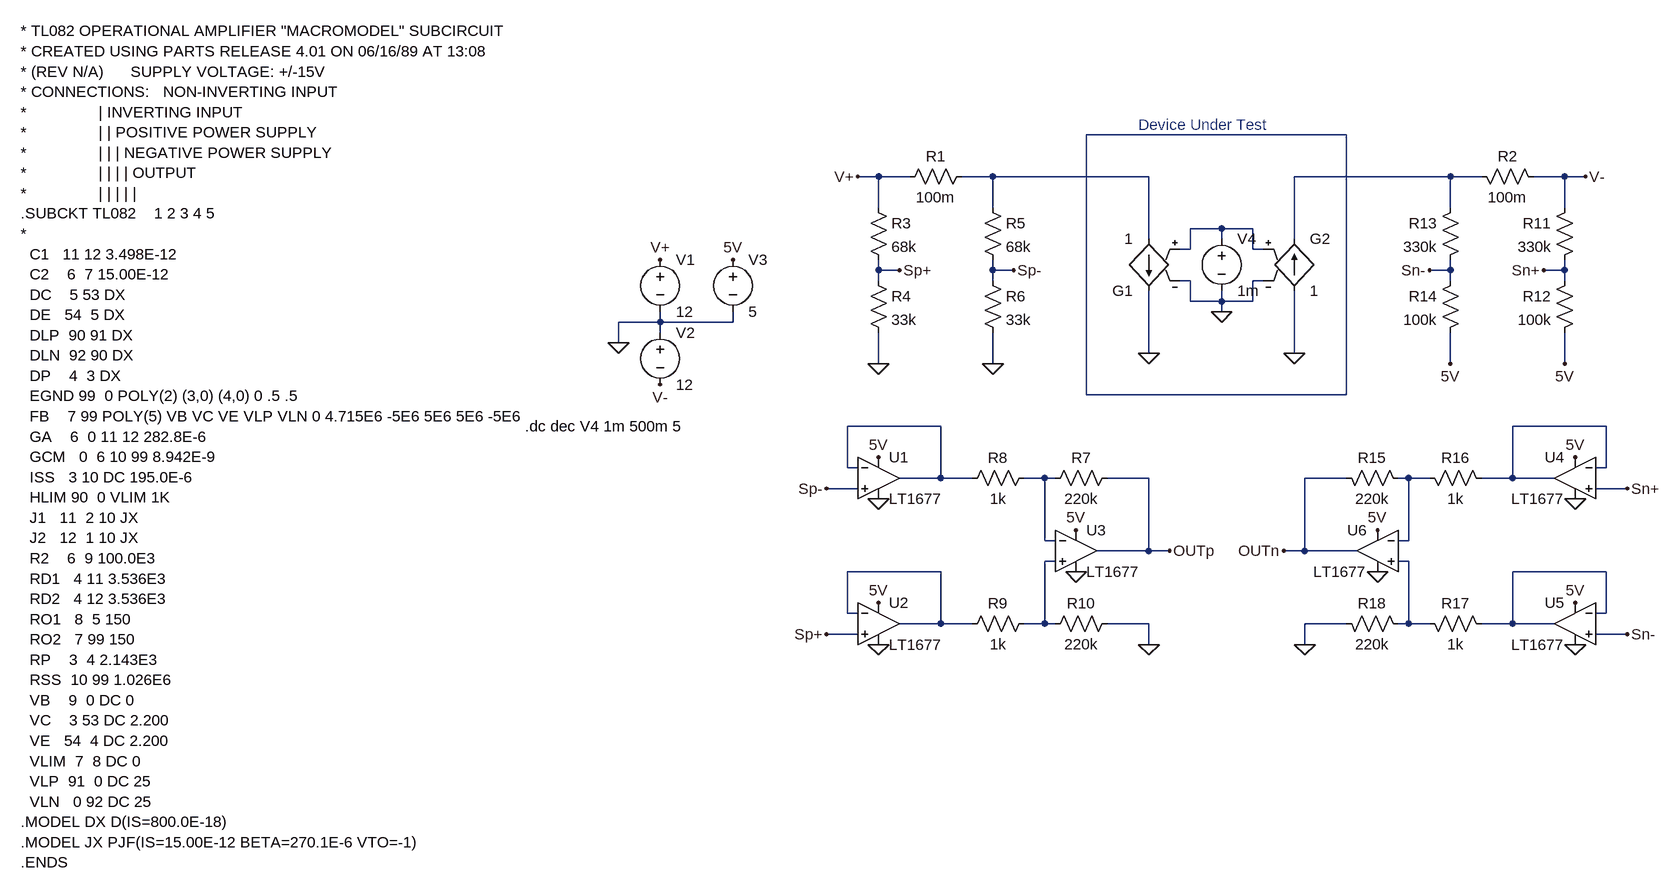
[diagram p0: schematic ModuleTester.asc]
ModuleTester.asc, the LTspice schematic file:
Version 4
SHEET 1 2688 2848
WIRE 368 -96 -32 -96
WIRE -352 -32 -384 -32
WIRE -304 -32 -352 -32
WIRE -176 -32 -224 -32
WIRE 64 -32 -176 -32
WIRE 528 -32 288 -32
WIRE 576 -32 528 -32
WIRE 704 -32 656 -32
WIRE 736 -32 704 -32
WIRE -352 16 -352 -32
WIRE -176 16 -176 -32
WIRE 528 16 528 -32
WIRE 704 16 704 -32
WIRE 176 48 128 48
WIRE 224 48 176 48
WIRE 64 64 64 -32
WIRE 176 64 176 48
WIRE 288 64 288 -32
WIRE 128 80 128 48
WIRE 128 80 112 80
WIRE 224 80 224 48
WIRE 240 80 224 80
WIRE -352 112 -352 96
WIRE -320 112 -352 112
WIRE -176 112 -176 96
WIRE -144 112 -176 112
WIRE 528 112 528 96
WIRE 528 112 496 112
WIRE 704 112 704 96
WIRE 704 112 672 112
WIRE -352 128 -352 112
WIRE -176 128 -176 112
WIRE 128 128 112 128
WIRE 240 128 224 128
WIRE 528 128 528 112
WIRE 704 128 704 112
WIRE 128 160 128 128
WIRE 176 160 176 144
WIRE 176 160 128 160
WIRE 224 160 224 128
WIRE 224 160 176 160
WIRE 176 176 176 160
WIRE -688 192 -688 176
WIRE -688 192 -752 192
WIRE -576 192 -576 176
WIRE -576 192 -688 192
WIRE -688 208 -688 192
WIRE -752 224 -752 192
WIRE 64 240 64 144
WIRE 288 240 288 144
WIRE -352 256 -352 208
WIRE -176 256 -176 208
WIRE 528 256 528 208
WIRE 704 256 704 208
WIRE -32 304 -32 -96
WIRE 368 304 368 -96
WIRE 368 304 -32 304
WIRE -256 352 -400 352
WIRE 768 352 624 352
WIRE -400 416 -400 352
WIRE -384 416 -400 416
WIRE 768 416 768 352
WIRE 768 416 752 416
WIRE -256 432 -256 352
WIRE -256 432 -320 432
WIRE -208 432 -256 432
WIRE -96 432 -128 432
WIRE -80 432 -96 432
WIRE 64 432 0 432
WIRE 368 432 304 432
WIRE 464 432 448 432
WIRE 496 432 464 432
WIRE 624 432 624 352
WIRE 624 432 576 432
WIRE 688 432 624 432
WIRE -384 448 -432 448
WIRE 800 448 752 448
WIRE -96 528 -96 432
WIRE -80 528 -96 528
WIRE 464 528 464 432
WIRE 464 528 448 528
WIRE 64 544 64 432
WIRE 64 544 -16 544
WIRE 96 544 64 544
WIRE 304 544 304 432
WIRE 304 544 272 544
WIRE 384 544 304 544
WIRE -80 560 -96 560
WIRE 464 560 448 560
WIRE -256 576 -400 576
WIRE 768 576 624 576
WIRE -400 640 -400 576
WIRE -384 640 -400 640
WIRE 768 640 768 576
WIRE 768 640 752 640
WIRE -256 656 -256 576
WIRE -256 656 -320 656
WIRE -208 656 -256 656
WIRE -96 656 -96 560
WIRE -96 656 -128 656
WIRE -80 656 -96 656
WIRE 64 656 0 656
WIRE 368 656 304 656
WIRE 464 656 464 560
WIRE 464 656 448 656
WIRE 496 656 464 656
WIRE 624 656 624 576
WIRE 624 656 576 656
WIRE 688 656 624 656
WIRE -384 672 -432 672
WIRE 800 672 752 672
WIRE 64 688 64 656
WIRE 304 688 304 656
FLAG -752 224 0
FLAG -688 288 V-
FLAG -688 96 V+
FLAG -384 -32 V+
FLAG 64 240 0
FLAG -352 256 0
FLAG -320 112 Sp+
FLAG -176 256 0
FLAG -144 112 Sp-
FLAG -576 96 5V
FLAG -432 672 Sp+
FLAG -432 448 Sp-
FLAG 64 688 0
FLAG 96 544 OUTp
FLAG -48 576 0
FLAG -352 688 0
FLAG -352 464 0
FLAG -352 400 5V
FLAG -48 512 5V
FLAG -352 624 5V
FLAG 736 -32 V-
FLAG 288 240 0
FLAG 672 112 Sn+
FLAG 496 112 Sn-
FLAG 176 176 0
FLAG 528 256 5V
FLAG 704 256 5V
FLAG 800 448 Sn+
FLAG 800 672 Sn-
FLAG 304 688 0
FLAG 272 544 OUTn
FLAG 416 576 0
FLAG 720 688 0
FLAG 720 464 0
FLAG 720 400 5V
FLAG 416 512 5V
FLAG 720 624 5V
SYMBOL voltage -688 80 R0
WINDOW 123 0 0 Left 0
WINDOW 39 0 0 Left 0
SYMATTR InstName V1
SYMATTR Value 12
SYMBOL voltage -688 192 R0
WINDOW 123 0 0 Left 0
WINDOW 39 0 0 Left 0
SYMATTR InstName V2
SYMATTR Value 12
SYMBOL res -208 -48 R90
WINDOW 0 0 56 VBottom 2
WINDOW 3 32 56 VTop 2
SYMATTR InstName R1
SYMATTR Value 100m
SYMBOL res -368 0 R0
SYMATTR InstName R3
SYMATTR Value 68k
SYMBOL res -368 112 R0
SYMATTR InstName R4
SYMATTR Value 33k
SYMBOL res -192 0 R0
SYMATTR InstName R5
SYMATTR Value 68k
SYMBOL res -192 112 R0
SYMATTR InstName R6
SYMATTR Value 33k
SYMBOL voltage -576 80 R0
WINDOW 123 0 0 Left 0
WINDOW 39 0 0 Left 0
SYMATTR InstName V3
SYMATTR Value 5
SYMBOL res 16 416 R90
WINDOW 0 0 56 VBottom 2
WINDOW 3 32 56 VTop 2
SYMATTR InstName R7
SYMATTR Value 220k
SYMBOL res -112 416 R90
WINDOW 0 0 56 VBottom 2
WINDOW 3 32 56 VTop 2
SYMATTR InstName R8
SYMATTR Value 1k
SYMBOL res -112 640 R90
WINDOW 0 0 56 VBottom 2
WINDOW 3 32 56 VTop 2
SYMATTR InstName R9
SYMATTR Value 1k
SYMBOL res 16 640 R90
WINDOW 0 0 56 VBottom 2
WINDOW 3 32 56 VTop 2
SYMATTR InstName R10
SYMATTR Value 220k
SYMBOL Opamps\\LT1677 -352 368 R0
SYMATTR InstName U1
SYMBOL Opamps\\LT1677 -352 592 R0
SYMATTR InstName U2
SYMBOL Opamps\\LT1677 -48 480 R0
SYMATTR InstName U3
SYMBOL g2 64 160 R180
SYMATTR InstName G1
SYMATTR Value 1
SYMBOL voltage 176 48 R0
WINDOW 123 0 0 Left 0
WINDOW 39 0 0 Left 0
SYMATTR InstName V4
SYMATTR Value 1m
SYMBOL res 560 -48 M90
WINDOW 0 0 56 VBottom 2
WINDOW 3 32 56 VTop 2
SYMATTR InstName R2
SYMATTR Value 100m
SYMBOL res 720 0 M0
SYMATTR InstName R11
SYMATTR Value 330k
SYMBOL res 720 112 M0
SYMATTR InstName R12
SYMATTR Value 100k
SYMBOL g 288 48 R0
SYMATTR InstName G2
SYMATTR Value 1
SYMBOL res 544 0 M0
SYMATTR InstName R13
SYMATTR Value 330k
SYMBOL res 544 112 M0
SYMATTR InstName R14
SYMATTR Value 100k
SYMBOL res 352 416 M90
WINDOW 0 0 56 VBottom 2
WINDOW 3 32 56 VTop 2
SYMATTR InstName R15
SYMATTR Value 220k
SYMBOL res 480 416 M90
WINDOW 0 0 56 VBottom 2
WINDOW 3 32 56 VTop 2
SYMATTR InstName R16
SYMATTR Value 1k
SYMBOL res 480 640 M90
WINDOW 0 0 56 VBottom 2
WINDOW 3 32 56 VTop 2
SYMATTR InstName R17
SYMATTR Value 1k
SYMBOL res 352 640 M90
WINDOW 0 0 56 VBottom 2
WINDOW 3 32 56 VTop 2
SYMATTR InstName R18
SYMATTR Value 220k
SYMBOL Opamps\\LT1677 720 368 M0
SYMATTR InstName U4
SYMBOL Opamps\\LT1677 720 592 M0
SYMATTR InstName U5
SYMBOL Opamps\\LT1677 416 480 M0
SYMATTR InstName U6
TEXT -1672 -256 Left 2 !* TL082 OPERATIONAL AMPLIFIER "MACROMODEL" SUBCIRCUIT\n* CREATED USING PARTS RELEASE 4.01 ON 06/16/89 AT 13:08\n* (REV N/A)      SUPPLY VOLTAGE: +/-15V\n* CONNECTIONS:   NON-INVERTING INPUT\n*                | INVERTING INPUT\n*                | | POSITIVE POWER SUPPLY\n*                | | | NEGATIVE POWER SUPPLY\n*                | | | | OUTPUT\n*                | | | | |\n.SUBCKT TL082    1 2 3 4 5\n*\n  C1   11 12 3.498E-12\n  C2    6  7 15.00E-12\n  DC    5 53 DX\n  DE   54  5 DX\n  DLP  90 91 DX\n  DLN  92 90 DX\n  DP    4  3 DX\n  EGND 99  0 POLY(2) (3,0) (4,0) 0 .5 .5\n  FB    7 99 POLY(5) VB VC VE VLP VLN 0 4.715E6 -5E6 5E6 5E6 -5E6\n  GA    6  0 11 12 282.8E-6\n  GCM   0  6 10 99 8.942E-9\n  ISS   3 10 DC 195.0E-6\n  HLIM 90  0 VLIM 1K\n  J1   11  2 10 JX\n  J2   12  1 10 JX\n  R2    6  9 100.0E3\n  RD1   4 11 3.536E3\n  RD2   4 12 3.536E3\n  RO1   8  5 150\n  RO2   7 99 150\n  RP    3  4 2.143E3\n  RSS  10 99 1.026E6\n  VB    9  0 DC 0\n  VC    3 53 DC 2.200\n  VE   54  4 DC 2.200\n  VLIM  7  8 DC 0\n  VLP  91  0 DC 25\n  VLN   0 92 DC 25\n.MODEL DX D(IS=800.0E-18)\n.MODEL JX PJF(IS=15.00E-12 BETA=270.1E-6 VTO=-1)\n.ENDS
TEXT -896 352 Left 2 !.dc dec V4 1m 500m 5
TEXT 48 -112 Left 2 ;Device Under Test

The netlist it stands for:
* ModuleTester.asc
V1 V+ 0 12
V2 0 V- 12
R1 N002 V+ 100m
R3 V+ Sp+ 68k
R4 Sp+ 0 33k
R5 N002 Sp- 68k
R6 Sp- 0 33k
V3 5V 0 5
R7 OUTp N007 220k
R8 N007 N005 1k
R9 N009 N011 1k
R10 0 N009 220k
XU1 Sp- N005 5V 0 N005 LT1677  ; pins In+ In- V+ V- OUT
XU2 Sp+ N011 5V 0 N011 LT1677  ; pins In+ In- V+ V- OUT
XU3 N009 N007 5V 0 OUTp LT1677  ; pins In+ In- V+ V- OUT
G1 N002 0 N004 0 1
V4 N004 0 1m
R2 N003 V- 100m
R11 V- Sn+ 330k
R12 Sn+ 5V 100k
G2 0 N003 N004 0 1
R13 N003 Sn- 330k
R14 Sn- 5V 100k
R15 OUTn N008 220k
R16 N008 N006 1k
R17 N010 N012 1k
R18 0 N010 220k
XU4 Sn+ N006 5V 0 N006 LT1677  ; pins In+ In- V+ V- OUT
XU5 Sn- N012 5V 0 N012 LT1677  ; pins In+ In- V+ V- OUT
XU6 N010 N008 5V 0 OUTn LT1677  ; pins In+ In- V+ V- OUT
* TL082 OPERATIONAL AMPLIFIER "MACROMODEL" SUBCIRCUIT
* CREATED USING PARTS RELEASE 4.01 ON 06/16/89 AT 13:08
* (REV N/A)      SUPPLY VOLTAGE: +/-15V
* CONNECTIONS:   NON-INVERTING INPUT
*                | INVERTING INPUT
*                | | POSITIVE POWER SUPPLY
*                | | | NEGATIVE POWER SUPPLY
*                | | | | OUTPUT
*                | | | | |
.SUBCKT TL082    1 2 3 4 5
*
  C1   11 12 3.498E-12
  C2    6  7 15.00E-12
  DC    5 53 DX
  DE   54  5 DX
  DLP  90 91 DX
  DLN  92 90 DX
  DP    4  3 DX
  EGND 99  0 POLY(2) (3,0) (4,0) 0 .5 .5
  FB    7 99 POLY(5) VB VC VE VLP VLN 0 4.715E6 -5E6 5E6 5E6 -5E6
  GA    6  0 11 12 282.8E-6
  GCM   0  6 10 99 8.942E-9
  ISS   3 10 DC 195.0E-6
  HLIM 90  0 VLIM 1K
  J1   11  2 10 JX
  J2   12  1 10 JX
  R2    6  9 100.0E3
  RD1   4 11 3.536E3
  RD2   4 12 3.536E3
  RO1   8  5 150
  RO2   7 99 150
  RP    3  4 2.143E3
  RSS  10 99 1.026E6
  VB    9  0 DC 0
  VC    3 53 DC 2.200
  VE   54  4 DC 2.200
  VLIM  7  8 DC 0
  VLP  91  0 DC 25
  VLN   0 92 DC 25
.MODEL DX D(IS=800.0E-18)
.MODEL JX PJF(IS=15.00E-12 BETA=270.1E-6 VTO=-1)
.ENDS
.dc dec V4 1m 500m 5
* Device Under Test
.lib LTC.lib
.backanno
.end